# Altium schematic sheet avionics-controller.SchDoc
size E
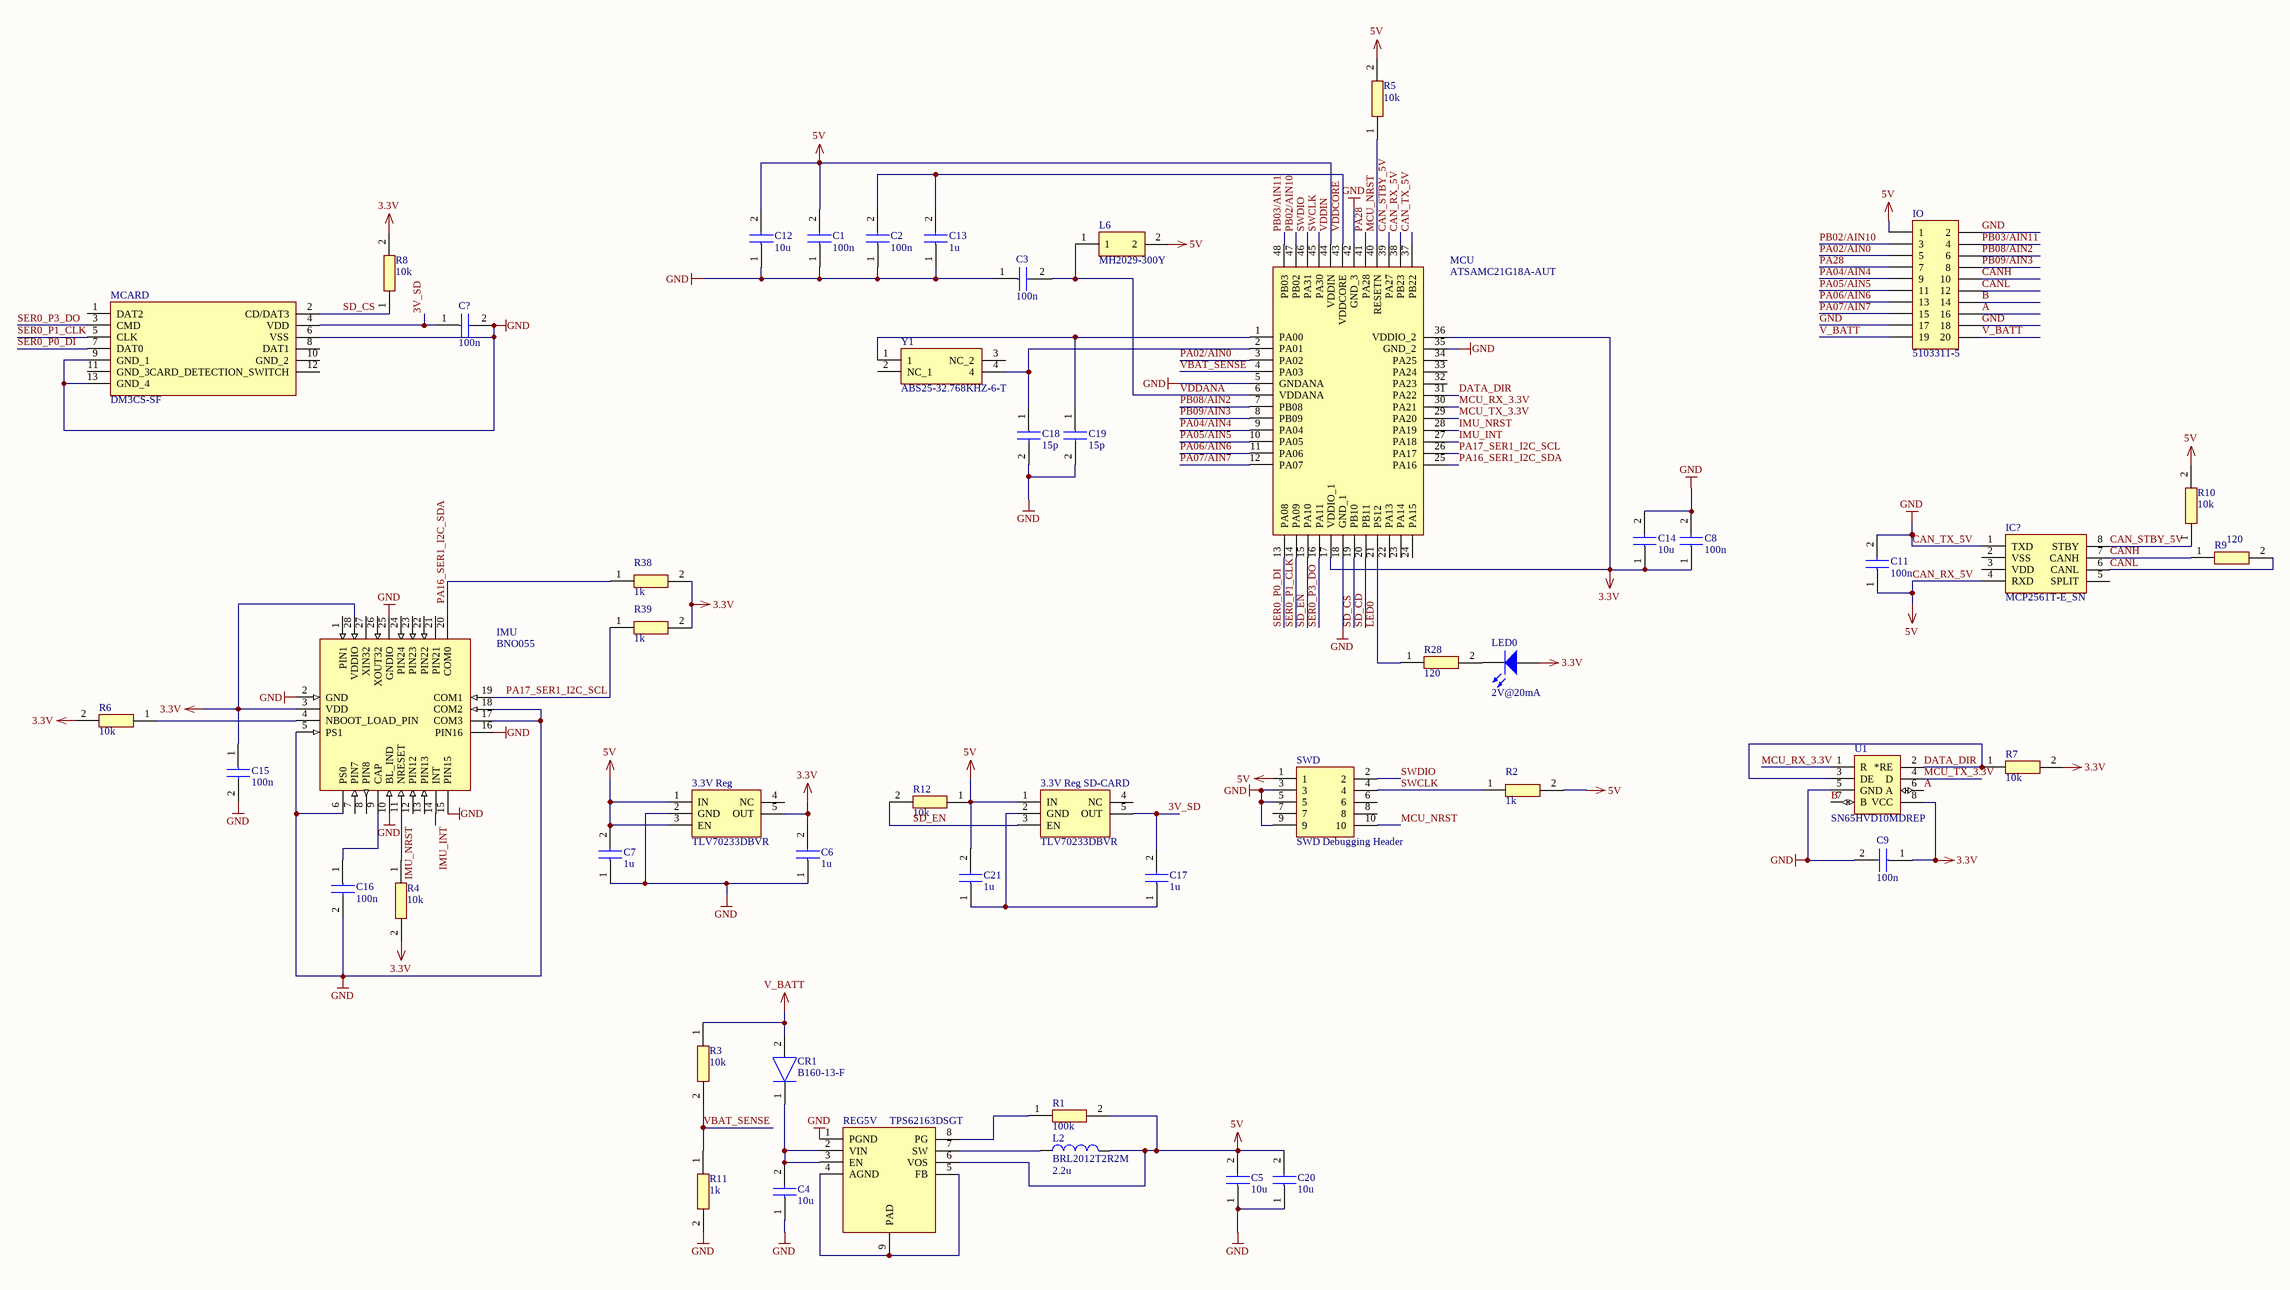
[diagram p0: avionics-controller.SchDoc]

## Parts
3.3V_Reg  TLV70233DBVR  [SOT95P280X145-5N]
3.3V_Reg_SD-CARD  TLV70233DBVR  [SOT95P280X145-5N]
C1  100n  [CAPC1005X55N]
C2  100n  [CAPC1005X55N]
C3  100n  [CAPC1005X55N]
C4  10u  [CAPC1608X80N]
C5  10u  [CAPC1608X80N]
C6  1u  [CAPC1005X55N]
C7  1u  [CAPC1005X55N]
C8  100n  [CAPC1005X55N]
C9  100n  [CAPC1005X55N]
C11  100n  [CAPC1005X55N]
C12  10u  [CAPC1608X80N]
C13  1u  [CAPC1005X55N]
C14  10u  [CAPC1608X80N]
C15  100n  [CAPC1005X55N]
C16  100n  [CAPC1005X55N]
C17  1u  [CAPC1005X55N]
C18  15p  [CAPC1005X56N]
C19  15p  [CAPC1005X56N]
C20  10u  [CAPC1608X80N]
C21  1u  [CAPC1005X55N]
C?  100n  [CAPC1005X55N]
CR1  B160-13-F  [DIOM5226X240N]
IC?  MCP2561T-E_SN  [SOIC127P600X175-8N]
IMU  BNO055  [BNO055]
IO  5103311-5  [HDR2X10H]
L2  BRL2012T2R2M  value 2.2u  [BRL2012T2R2M-2]
L6  MH2029-300Y  [BEADC2016X130N]
LED0  2V@20mA  [0603]
MCARD  DM3CS-SF  [DM3CS-SF]
MCU  ATSAMC21G18A-AUT  [QFP50P900X900X120-48N]
R1  100k  [RESC1005X40N]
R2  1k  [RESC1005X40N]
R3  10k  [RESC1005X40N]
R4  10k  [RESC1005X40N]
R5  10k  [RESC1005X40N]
R6  10k  [RESC1005X40N]
R7  10k  [RESC1005X40N]
R8  10k  [RESC1005X40N]
R9  120  [RESC1005X40N]
R10  10k  [RESC1005X40N]
R11  1k  [RESC1005X40N]
R12  10k  [RESC1005X40N]
R28  120  [RESC1005X40N]
R38  1k  [RESC1005X40N]
R39  1k  [RESC1005X40N]
REG5V  TPS62163DSGT  [SON50P200X200X80-9N]
SWD  SWD Debugging Header  [HDRV10W41P127_2X5_635X343X758P]
U1  SN65HVD10MDREP  [SO8_N]
Y1  ABS25-32.768KHZ-6-T  [ABS25]

## Nets
3.3V: 3.3V_Reg.5(OUT) C6.2 C8.1 C9.1 C14.1 C15.1 IMU.3(VDD) IMU.28(VDDIO) LED0.1(A) MCU.17(VDDIO_1) MCU.36(VDDIO_2) R4.2(R2) R6.2(R2) R7.2(R2) R8.2(R2) R38.2(R2) R39.2(R2) U1.8(VCC)
CAN_RX_5V: 3.3V_Reg.1(IN) 3.3V_Reg.3(EN) 3.3V_Reg_SD-CARD.1(IN) C1.2 C5.2 C7.2 C11.1 C12.2 C20.2 C21.2 IC?.4(RXD) IO.1 L2.2 L6.2 MCU.38(PB23) MCU.44(VDDIN) R1.2(R2) R2.2(R2) R5.2(R2) R10.2(R2) R12.1(R1) REG5V.6(VOS) SWD.1  [also labelled 5V, VDDIN]
CAN_TX_5V: 3.3V_Reg.2(GND) C1.1 C2.1 C3.1 C4.1 C5.1 C6.1 C7.1 C8.2 C9.2 C11.2 C12.1 C13.1 C14.2 C15.2 C16.2 C18.2 C19.2 C20.1 C?.2 IC?.1(TXD) IMU.2(GND) IMU.5(PS1) IMU.6(PS0) IMU.10(BL_IND) IMU.15(PIN15) IMU.16(PIN16) IMU.17(COM3) IMU.18(COM2) IMU.25(GNDIO) IO.2 IO.17 IO.18 MCARD.6(VSS) MCARD.9(GND_1) MCARD.13(GND_4) MCU.5(GNDANA) MCU.18(GND_1) MCU.35(GND_2) MCU.37(PB22) MCU.42(GND_3) R11.2(R2) REG5V.1(PGND) SWD.3 SWD.5 SWD.9 U1.5(GND)  [also labelled GND]
V_BATT: CR1.2(A) IO.19 IO.20 R3.1(R1)
3V_SD: 3.3V_Reg_SD-CARD.5(OUT) C17.2 C?.1 MCARD.4(VDD)
A: IO.16 U1.6(A)
B: IO.14 U1.7(B)
CAN_STBY_5V: IC?.8(STBY) MCU.39(PA27) R10.1(R1)
CANH: IC?.7(CANH) IO.10 R9.1(R1)
CANL: IC?.6(CANL) IO.12 R9.2(R2)
DATA_DIR: MCU.31(PA22) R7.1(R1) U1.2(*RE) U1.3(DE)
IMU_INT: IMU.14(INT) MCU.27(PA18)
IMU_NRST: IMU.11(NRESET) MCU.28(PA19) R4.1(R1)
LED0: MCU.21(PS12) R28.1(R1)
MCU_NRST: MCU.40(RESETN) R5.1(R1) SWD.10
MCU_RX_3.3V: MCU.30(PA21) U1.1(R)
MCU_TX_3.3V: MCU.29(PA20) U1.4(D)
PA02/AIN0: IO.5 MCU.3(PA02)
PA04/AIN4: IO.9 MCU.9(PA04)
PA05/AIN5: IO.11 MCU.10(PA05)
PA06/AIN6: IO.13 MCU.11(PA06)
PA07/AIN7: IO.15 MCU.12(PA07)
PA16_SER1_I2C_SDA: IMU.20(COM0) MCU.25(PA16) R38.1(R1)
PA17_SER1_I2C_SCL: IMU.19(COM1) MCU.26(PA17) R39.1(R1)
PA28: IO.7 MCU.41(PA28)
PB02/AIN10: IO.3 MCU.47(PB02)
PB03/AIN11: IO.4 MCU.48(PB03)
PB08/AIN2: IO.6 MCU.7(PB08)
PB09/AIN3: IO.8 MCU.8(PB09)
SD_CD: MCU.20(PB11)
SD_CS: MCARD.2(CD/DAT3) MCU.19(PB10) R8.1(R1)
SD_EN: 3.3V_Reg_SD-CARD.3(EN) MCU.15(PA10) R12.2(R2)
SER0_P0_DI: MCARD.7(DAT0) MCU.13(PA08)
SER0_P1_CLK: MCARD.5(CLK) MCU.14(PA09)
SER0_P3_DO: MCARD.3(CMD) MCU.16(PA11)
SWCLK: MCU.45(PA30) R2.1(R1) SWD.4
SWDIO: MCU.46(PA31) SWD.2
VBAT_SENSE: MCU.4(PA03) R3.2(R2) R11.1(R1)
VDDANA: C3.2 L6.1 MCU.6(VDDANA)
VDDCORE: C2.2 C13.2 MCU.43(VDDCORE)
Net3.3V_Reg_SD-CARD_2: 3.3V_Reg_SD-CARD.2(GND) C17.1 C21.1
NetC4_2: C4.2 CR1.1(K) REG5V.2(VIN) REG5V.3(EN)
NetC16_1: C16.1 IMU.9(CAP)
NetC18_1: C18.1 MCU.2(PA01) Y1.4
NetC19_1: C19.1 MCU.1(PA00) Y1.1
NetIMU_4: IMU.4(NBOOT_LOAD_PIN) R6.1(R1)
NetL2_1: L2.1 REG5V.7(SW)
NetLED0_2: LED0.2(K) R28.2(R2)
NetR1_1: R1.1(R1) REG5V.8(PG)
NetREG5V_4: REG5V.4(AGND) REG5V.5(FB) REG5V.9(PAD)

Not connected (* = marked no-connect by the designer): 3.3V_Reg 4(NC); 3.3V_Reg_SD-CARD 4(NC); IC? 2(VSS) 3(VDD) 5(SPLIT); IMU 1(PIN1) 7(PIN7) 8(PIN8) 12(PIN12) 13(PIN13) 21(PIN21) 22(PIN22) 23(PIN23) 24(PIN24) 26(XOUT32) 27(XIN32); MCARD 1(DAT2) 8(DAT1) 10(GND_2) 11(GND_3) 12(CARD_DETECTION_SWITCH); MCU 22(PA13) 23(PA14) 24(PA15) 32(PA23) 33(PA24) 34(PA25); SWD 6 7 8; Y1 2(NC_1) 3(NC_2)

## Library data of the parts
3.3V_Reg 3.3V_Reg_SD-CARD = TLV70233DBVR: Integrated Circuit; Manufacturer_Name: Texas Instruments; Datasheet Link: http://www.ti.com/lit/gpn/tlv702; Height: 1.45mm; Manufacturer_Part_Number: TLV70233DBVR; Mouser Part Number: 595-TLV70233DBVR; Mouser Price/Stock: https://www.mouser.com/Search/Refine.aspx?Keyword=595-TLV70233DBVR
C1-C3 C8 C9 C11 C15 C16 C? = GRM155R71C104KA88D: Capacitor; Manufacturer_Name: Murata Electronics; Datasheet Link: http://www.murata.com/~/media/webrenewal/support/library/catalog/products/capacitor/mlcc/c02e.pdf; Height: 0.55mm; Manufacturer_Part_Number: GRM155R71C104KA88D; Mouser Part Number: N/A; RS Part Number: 6242317P; RS Price/Stock: http://uk.rs-online.com/web/p/products/6242317P
C4 C5 C12 C14 C20 = C1608X5R1C106M080AB: Capacitor; Manufacturer_Name: TDK; Datasheet Link: https://product.tdk.com/info/en/catalog/datasheets/mlcc_commercial_midvoltage_en.pdf; Height: 0.8mm; Manufacturer_Part_Number: C1608X5R1C106M080AB; Mouser Part Number: 810-C1608X5R1C106M; Mouser Price/Stock: https://www.mouser.com/Search/Refine.aspx?Keyword=810-C1608X5R1C106M; RS Part Number: 9159120P; RS Price/Stock: http://uk.rs-online.com/web/p/products/9159120P
C6 C7 C13 C17 C21 = C1005X5R1C105K050BC: Capacitor; Manufacturer_Name: TDK; Datasheet Link: https://product.tdk.com/info/en/documents/chara_sheet/C1005X5R1C105K050BC.pdf; Height: 0.55mm; Manufacturer_Part_Number: C1005X5R1C105K050BC; Mouser Part Number: 810-C1005X5R1C105K; Mouser Price/Stock: https://www.mouser.com/Search/Refine.aspx?Keyword=810-C1005X5R1C105K; RS Part Number: 9214062; RS Price/Stock: http://uk.rs-online.com/web/p/products/9214062
C18 C19 = 04025A150JAT2A: Capacitor; Manufacturer_Name: AVX; Allied_Number: 70001388; Datasheet Link: http://datasheets.avx.com/C0GNP0-Dielectric.pdf; Height: 0.56mm; Manufacturer_Part_Number: 04025A150JAT2A; Mouser Part Number: 581-04025A150J; Mouser Price/Stock: https://www.mouser.com/Search/Refine.aspx?Keyword=581-04025A150J; RS Part Number: 6983071P; RS Price/Stock: http://uk.rs-online.com/web/p/products/6983071P; Allied Price/Stock: http://www.alliedelec.com/avx-04025a150jat2a/70001388/
CR1 = B160-13-F: Diode; Manufacturer_Name: Diodes Inc.; Allied_Number: 71028107; Datasheet Link: http://uk.rs-online.com/web/p/products/7384765; Height: 2.4mm; Manufacturer_Part_Number: B160-13-F; Mouser Part Number: 621-B160-F; Mouser Price/Stock: https://www.mouser.com/Search/Refine.aspx?Keyword=621-B160-F; RS Part Number: 7384765P; RS Price/Stock: http://uk.rs-online.com/web/p/products/7384765P; Allied Price/Stock: https://www.alliedelec.com/diodes-inc-b160-13-f/71028107/
IC? = MCP2561T-E_SN: Integrated Circuit; Manufacturer_Name: Microchip; Manufacturer_Part_Number: MCP2561T-E/SN; Allied_Number: 70454196; Datasheet Link: http://www.mouser.com/ds/2/268/25167B-245700.pdf; Height: 1.75mm; Mouser Part Number: 579-MCP2561T-E/SN; Mouser Price/Stock: https://www.mouser.com/Search/Refine.aspx?Keyword=579-MCP2561T-E%2FSN; RS Part Number: 1772855; RS Price/Stock: http://uk.rs-online.com/web/p/products/1772855; Allied Price/Stock: https://www.alliedelec.com/microchip-technology-inc-mcp2561t-e-sn/70454196/
IMU = BNO055: Integrated Circuit; Manufacturer_Name: Bosch Sensortec; Datasheet Link: https://ae-bst.resource.bosch.com/media/_tech/media/datasheets/BST_BNO055_DS000_14.pdf; Height: 1mm; Manufacturer_Part_Number: BNO055; Mouser Part Number: 262-BNO055; Mouser Price/Stock: https://www.mouser.com/Search/Refine.aspx?Keyword=262-BNO055; RS Part Number: 8496171
IO = Header 10X2H: Header, 10-Pin, Dual row, Right Angle; LatestRevisionDate: 17-Jul-2002; LatestRevisionNote: Re-released for DXP Platform.; Publisher: Altium Limited
L2 = Inductor: Code_IEC: 1005; Published: 8-Jun-2000; LatestRevisionDate: 29-May-2009; LatestRevisionNote: IPC-7351 Footprint Added.; PackageReference: 0402-A; Publisher: Altium Limited; PackageDescription: Chip Inductor; Code_JEITA: 0402
L6 = MH2029-300Y: Ferrite Bead; Manufacturer_Name: Bourns; Allied_Number: 71024701; Datasheet Link: http://www.mouser.com/ds/2/54/h-777565.pdf; Height: 1.3mm; Manufacturer_Part_Number: MH2029-300Y; Mouser Part Number: 652-MH2029-300Y; Mouser Price/Stock: https://www.mouser.com/Search/Refine.aspx?Keyword=652-MH2029-300Y; RS Part Number: 1814464; RS Price/Stock: http://uk.rs-online.com/web/p/products/1814464; Allied Price/Stock: https://www.alliedelec.com/bourns-mh2029-300y/71024701/
LED0 = LED1: LS Q976-NR-1; Published: 8-Jun-2000; LatestRevisionDate: 08-Jul-2005; LatestRevisionNote: Mech Layer 1 removed.; PackageReference: LED-1; Publisher: Altium Limited; PackageDescription: LED; 2 Leads
MCARD = DM3CS-SF: Connector; Manufacturer_Name: Hirose; Datasheet Link: http://docs-emea.rs-online.com/webdocs/118f/0900766b8118f8bb.pdf; Manufacturer_Part_Number: DM3CS-SF; Mouser Part Number: 798-DM3CSSF; Mouser Price/Stock: https://www.mouser.com/Search/Refine.aspx?Keyword=798-DM3CSSF; RS Part Number: 1664833; RS Price/Stock: http://uk.rs-online.com/web/p/products/1664833
MCU = ATSAMC21G18A-AUT: Integrated Circuit; Manufacturer_Name: Microchip; Datasheet Link: http://www.mouser.com/ds/2/36/Atmel-42365-SAMC21_Datasheet-894213.pdf; Height: 1.2mm; Manufacturer_Part_Number: ATSAMC21G18A-AUT; Mouser Part Number: 556-ATSAMC21G18A-AUT; Mouser Price/Stock: https://www.mouser.com/Search/Refine.aspx?Keyword=556-ATSAMC21G18A-AUT
R1 = ERJ-2GEJ104X: Resistor; Manufacturer_Name: Panasonic; Allied_Number: 70264918; Manufacturer_Part_Number: ERJ-2GEJ104X; Mouser Part Number: 667-ERJ-2GEJ104X; Mouser Price/Stock: https://www.mouser.com/Search/Refine.aspx?Keyword=667-ERJ-2GEJ104X; Allied Price/Stock: https://www.alliedelec.com/panasonic-erj-2gej104x/70264918/
R2 R11 R38 R39 = ERJ-2GEJ102X: Resistor; Manufacturer_Name: Panasonic; Allied_Number: 70264916; Datasheet Link: http://componentsearchengine.com/Datasheets/1/ERJ-2GEJ102X.pdf; Manufacturer_Part_Number: ERJ-2GEJ102X; Mouser Part Number: 667-ERJ-2GEJ102X; Mouser Price/Stock: https://www.mouser.com/Search/Refine.aspx?Keyword=667-ERJ-2GEJ102X; Allied Price/Stock: https://www.alliedelec.com/panasonic-erj-2gej102x/70264916/
R3-R8 R10 R12 = ERJ-2GEJ103X: Resistor; Manufacturer_Name: Panasonic; Allied_Number: 70264917; Datasheet Link: http://componentsearchengine.com/Datasheets/1/ERJ-2GEJ103X.pdf; Manufacturer_Part_Number: ERJ-2GEJ103X; Mouser Part Number: 667-ERJ-2GEJ103X; Mouser Price/Stock: https://www.mouser.com/Search/Refine.aspx?Keyword=667-ERJ-2GEJ103X; Allied Price/Stock: https://www.alliedelec.com/panasonic-erj-2gej103x/70264917/
R9 R28 = ERJ-2GEJ103X: ERJ-2GEJ102X; Manufacturer_Name: Panasonic; Allied_Number: 70264917; Datasheet Link: http://componentsearchengine.com/Datasheets/1/ERJ-2GEJ103X.pdf; Manufacturer_Part_Number: ERJ-2GEJ103X; Mouser Part Number: 667-ERJ-2GEJ103X; Mouser Price/Stock: https://www.mouser.com/Search/Refine.aspx?Keyword=667-ERJ-2GEJ103X; Allied Price/Stock: https://www.alliedelec.com/panasonic-erj-2gej103x/70264917/
REG5V = RT8077GQW: Integrated Circuit; Manufacturer_Name: Richtek USA Inc.; Datasheet Link: http://www.richtek.com/assets/product_file/RT8077/DS8077-01.pdf; Height: 0.8mm; Manufacturer_Part_Number: RT8077GQW
SWD = 20021111-00010T4LF: Connector; Manufacturer_Name: FCI / Amphenol; Allied_Number: 70475647; Datasheet Link: https://www.mouser.it/datasheet/2/18/20021111-1362952.pdf; Height: 7.58mm; Manufacturer_Part_Number: 20021111-00010T4LF; Mouser Part Number: 649-221111-00010T4LF; Allied Price/Stock: https://www.alliedelec.com/amphenolfci-20021111-00010t4lf/70475647/
U1 = Header 4X2: LatestRevisionDate: 17-Jul-2002; LatestRevisionNote: Re-released for DXP Platform.; Publisher: Altium Limited
Y1 = ABS25-32.768KHZ-6-T: Crystal or Oscillator; Manufacturer_Name: ABRACON; Datasheet Link: http://www.abracon.com/Resonators/abs25.pdf; Manufacturer_Part_Number: ABS25-32.768KHZ-6-T; Mouser Part Number: 815-ABS25-32.768K6-T; Mouser Price/Stock: https://www.mouser.com/Search/Refine.aspx?Keyword=815-ABS25-32.768K6-T; RS Part Number: 1712795; RS Price/Stock: http://uk.rs-online.com/web/p/products/1712795